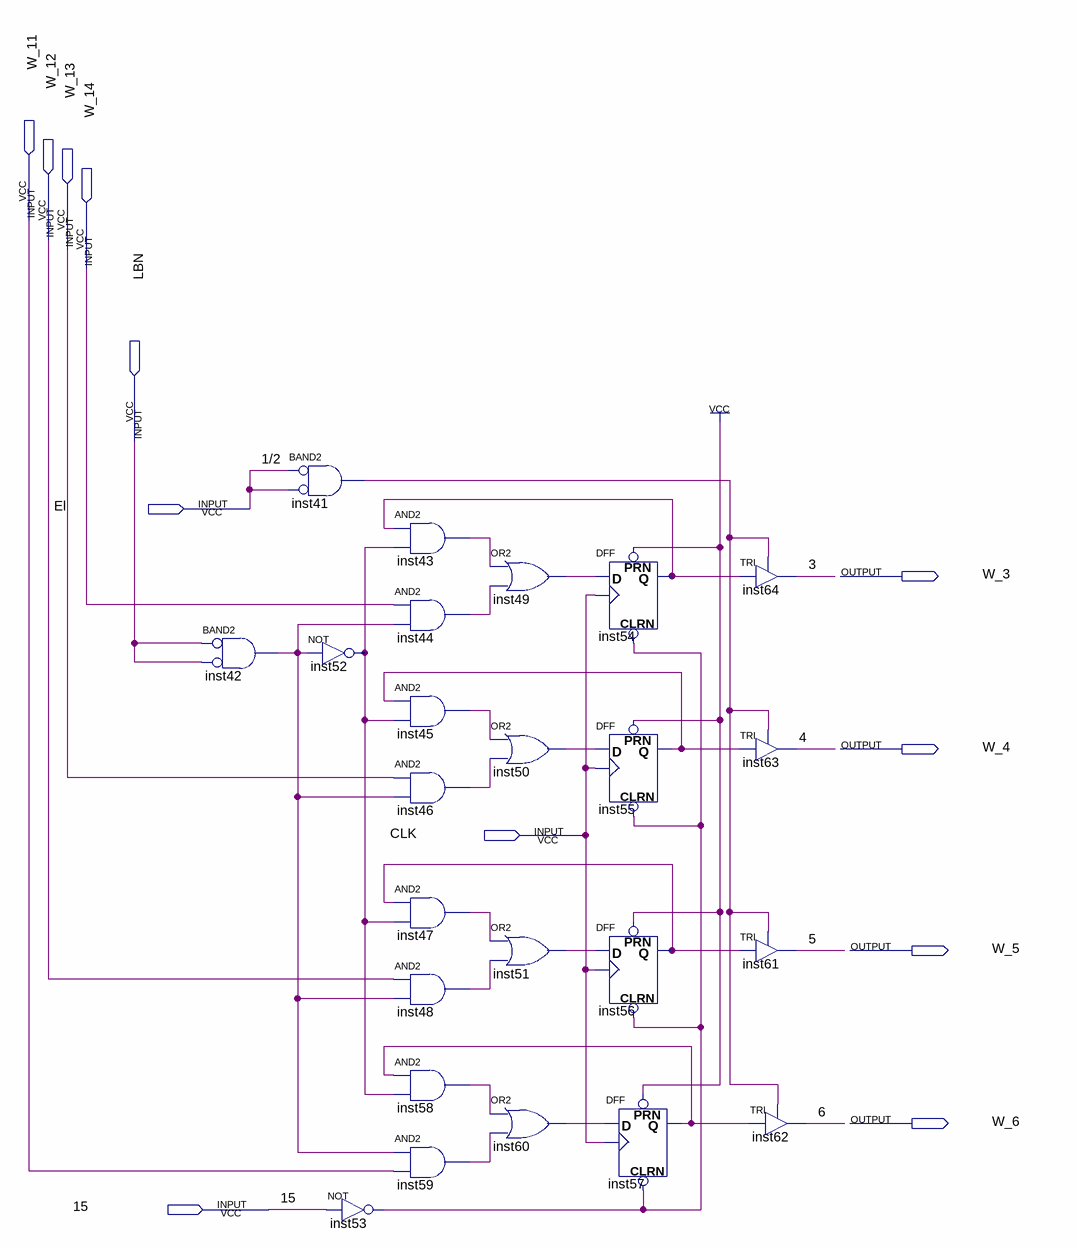
[diagram p0: schematic sheet]
// Quartus schematic Registrador_instrucao.bdf as structural Verilog: 24 symbols, 12 pins
module Registrador_instrucao (
  input  W_11,
  input  W_12,
  input  W_13,
  input  W_14,
  input  LBN,
  input  El,
  input  CLK,
  input  \15 ,
  output W_3,
  output W_4,
  output W_5,
  output W_6
);

  wire inst41_out, inst42_out, inst43_out, inst44_out, inst45_out, inst46_out, inst47_out, inst48_out,
       inst49_out, inst50_out, inst51_out, inst52_out, inst53_out, inst54_q, inst55_q, inst56_q, inst57_q,
       inst58_out, inst59_out, inst60_out;

  and inst42 (inst42_out, ~LBN, ~LBN);  // BAND2
  and inst41 (inst41_out, ~El, ~El);  // BAND2
  not inst52 (inst52_out, inst42_out);
  not inst53 (inst53_out, \15 );
  and inst43 (inst43_out, inst54_q, inst52_out);
  and inst44 (inst44_out, W_14, inst42_out);
  and inst45 (inst45_out, inst55_q, inst52_out);
  and inst46 (inst46_out, W_13, inst42_out);
  and inst47 (inst47_out, inst56_q, inst52_out);
  and inst48 (inst48_out, W_12, inst42_out);
  and inst58 (inst58_out, inst57_q, inst52_out);
  and inst59 (inst59_out, inst42_out, W_11);
  or inst49 (inst49_out, inst43_out, inst44_out);
  or inst50 (inst50_out, inst45_out, inst46_out);
  or inst51 (inst51_out, inst47_out, inst48_out);
  or inst60 (inst60_out, inst58_out, inst59_out);
  DFF inst54 (.CLRN(inst53_out), .CLK(CLK), .D(inst49_out), .PRN(1'b1), .Q(inst54_q));
  DFF inst55 (.CLRN(inst53_out), .CLK(CLK), .D(inst50_out), .PRN(1'b1), .Q(inst55_q));
  DFF inst56 (.CLRN(inst53_out), .CLK(CLK), .D(inst51_out), .PRN(1'b1), .Q(inst56_q));
  DFF inst57 (.CLRN(inst53_out), .CLK(CLK), .D(inst60_out), .PRN(1'b1), .Q(inst57_q));
  TRI inst64 (.IN(inst54_q), .OE(inst41_out), .OUT(W_3));
  TRI inst63 (.IN(inst55_q), .OE(inst41_out), .OUT(W_4));
  TRI inst61 (.IN(inst56_q), .OE(inst41_out), .OUT(W_5));
  TRI inst62 (.IN(inst57_q), .OE(inst41_out), .OUT(W_6));

  // Other names for the same wires on the sheet: 3 = W_3; 4 = W_4; 5 = W_5; 6 = W_6; 1/2 = El
endmodule
